# Altium schematic sheet 425AK01A_S10.SchDoc
size A3; DocumentNumber: 10; SheetNumber: 10; SheetTotal: 10; PageSetup: Record=PageOptions|CenterHorizontal=True|CenterVertical=True|PrintScale=1.01|XCorrection=1.00|YCorrection=1.00|PrintKind=1|BorderSize=5000000|LeftOffset=0|BottomOffset=0|Orientation=2|PaperLength=1000|PaperWidth=1000|Scale=100|PaperSource=15|PrintQuality=600|MediaType=1|DitherType=10|PaperKind=A3|PrintScaleMode=1; 00_Drawn: RJG; 00_Date: 8APR2022; 00_Checked: SR; 00_Approved: GN; 00_Line1: PSUs
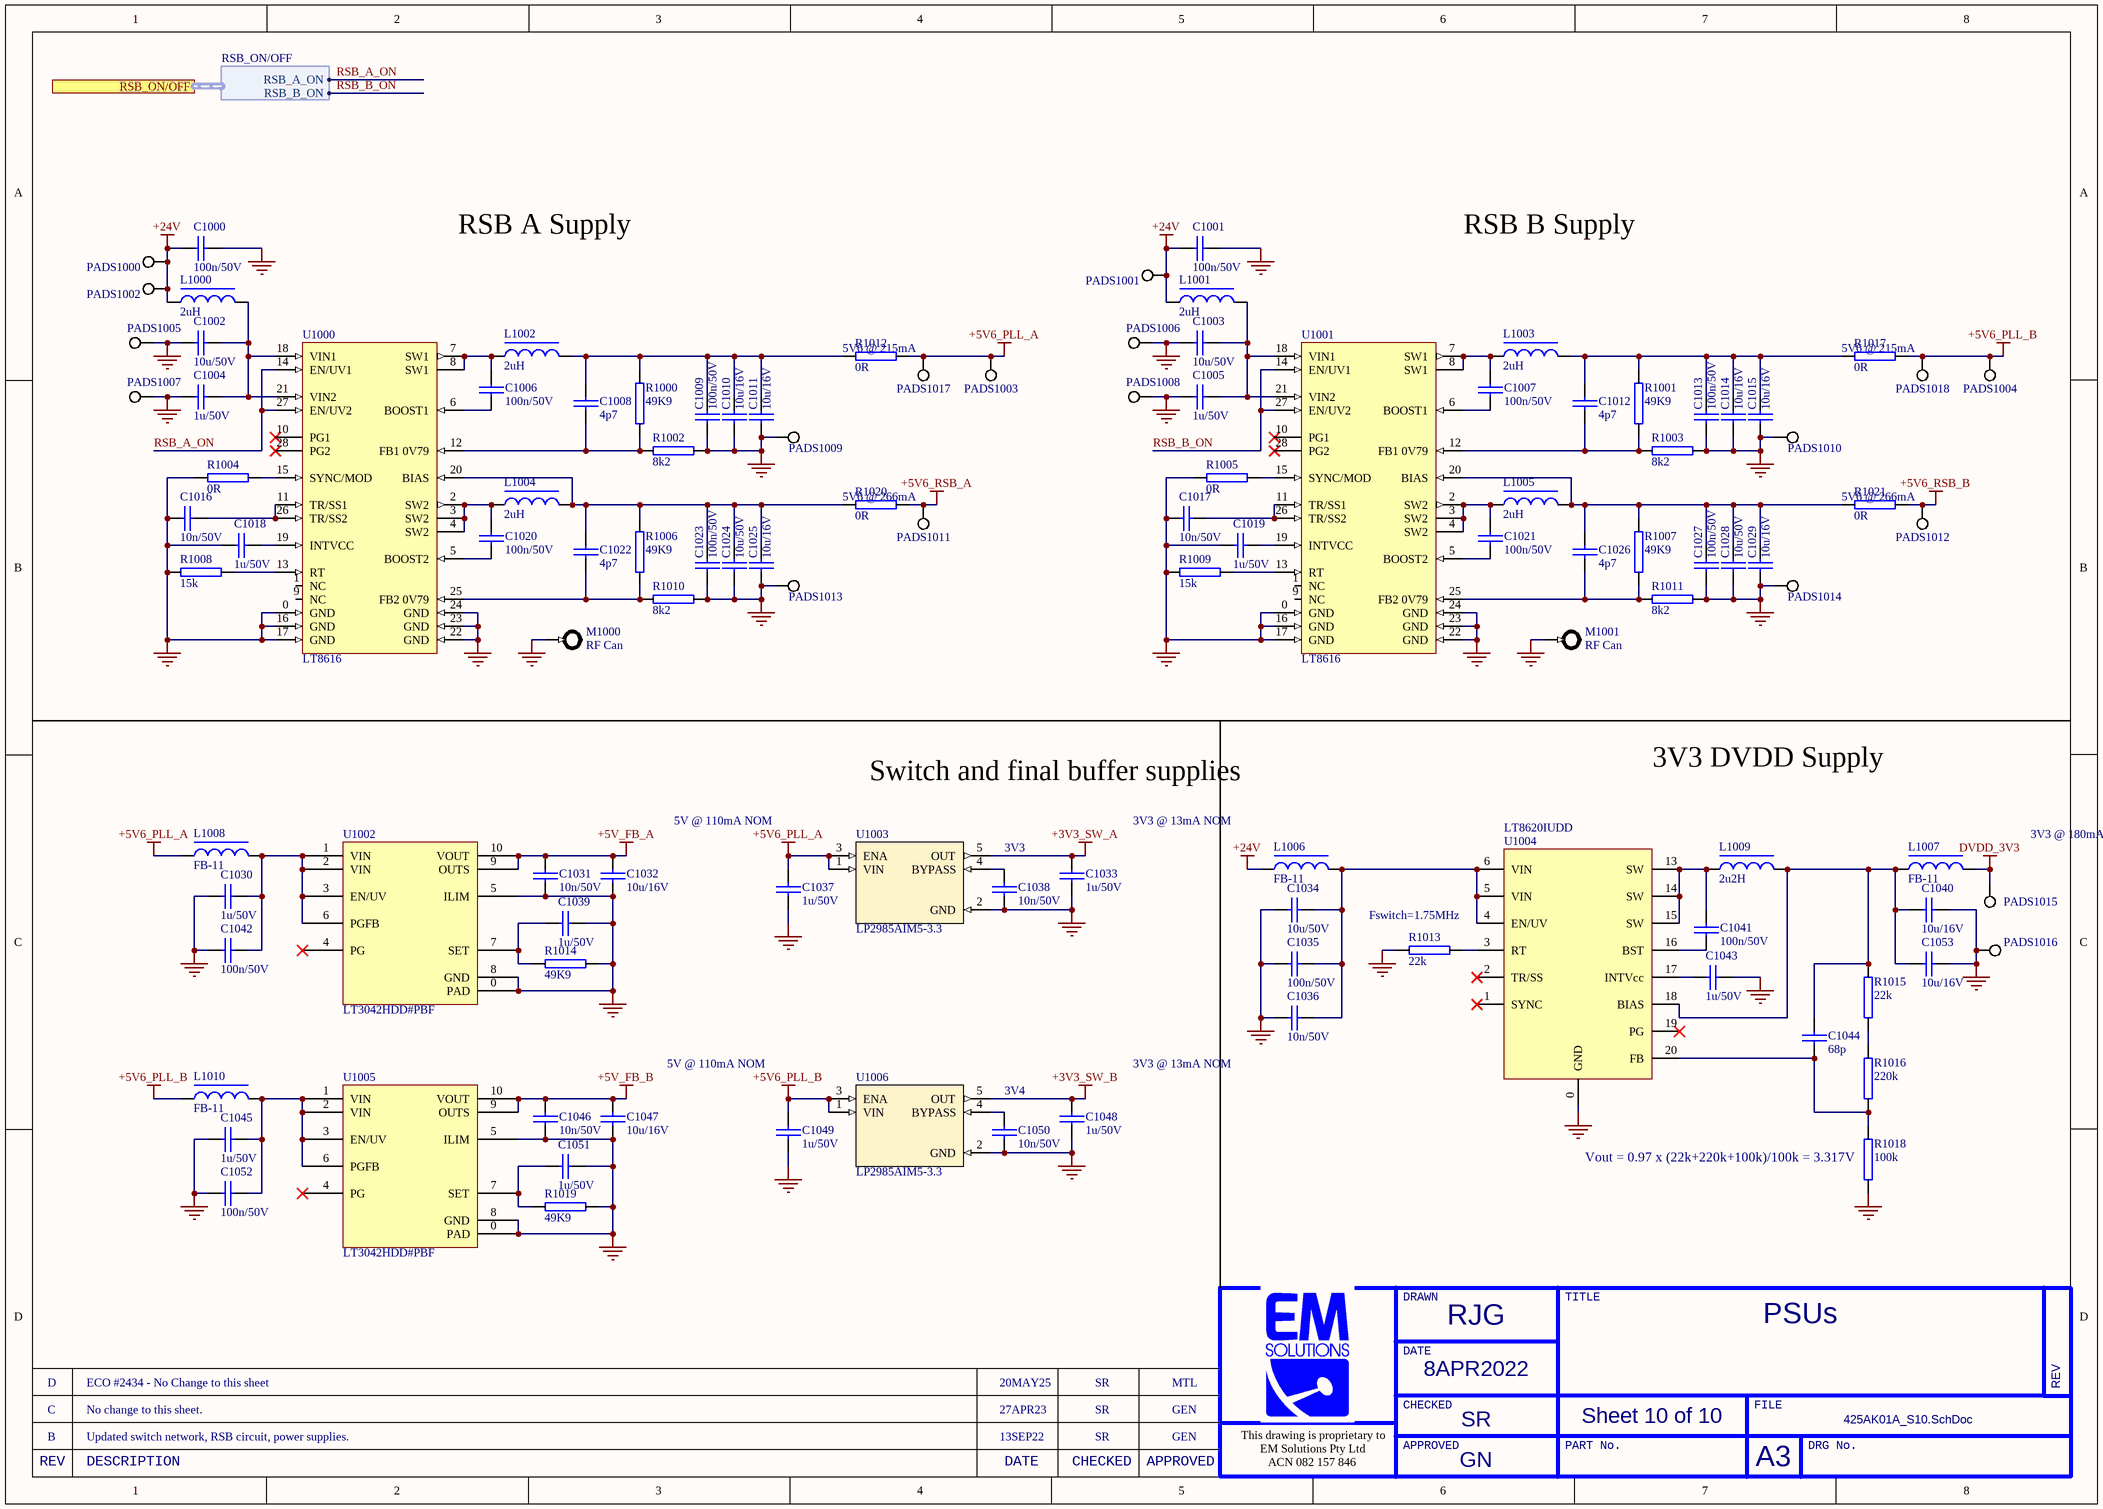
[diagram p0: 425AK01A_S10.SchDoc]

## Parts
C1000  100n/50V  [0402C]
C1001  100n/50V  [0402C]
C1002  10u/50V  [1206C]
C1003  10u/50V  [1206C]
C1004  1u/50V  [0603C]
C1005  1u/50V  [0603C]
C1006  100n/50V  [0402C]
C1007  100n/50V  [0402C]
C1008  4p7  [0402C]
C1009  100n/50V  [0402C]
C1010  10u/16V  [0805C]
C1011  10u/16V  [0805C]
C1012  4p7  [0402C]
C1013  100n/50V  [0402C]
C1014  10u/16V  [0805C]
C1015  10u/16V  [0805C]
C1016  10n/50V  [0402C]
C1017  10n/50V  [0402C]
C1018  1u/50V  [0603C]
C1019  1u/50V  [0603C]
C1020  100n/50V  [0402C]
C1021  100n/50V  [0402C]
C1022  4p7  [0402C]
C1023  100n/50V  [0402C]
C1024  10u/50V  [1206C]
C1025  10u/16V  [0805C]
C1026  4p7  [0402C]
C1027  100n/50V  [0402C]
C1028  10u/50V  [1206C]
C1029  10u/16V  [0805C]
C1030  1u/50V  [0603C]
C1031  10n/50V  [0402C]
C1032  10u/16V  [0805C]
C1033  1u/50V  [0603C]
C1034  10u/50V  [1206C]
C1035  100n/50V  [0402C]
C1036  10n/50V  [0402C]
C1037  1u/50V  [0603C]
C1038  10n/50V  [0402C]
C1039  1u/50V  [0603C]
C1040  10u/16V  [0805C]
C1041  100n/50V  [0402C]
C1042  100n/50V  [0402C]
C1043  1u/50V  [0603C]
C1044  68p  [0402C]
C1045  1u/50V  [0603C]
C1046  10n/50V  [0402C]
C1047  10u/16V  [0805C]
C1048  1u/50V  [0603C]
C1049  1u/50V  [0603C]
C1050  10n/50V  [0402C]
C1051  1u/50V  [0603C]
C1052  100n/50V  [0402C]
C1053  10u/16V  [0805C]
L1000  2uH  [XFL4030]
L1001  2uH  [XFL4030]
L1002  2uH  [XFL4030]
L1003  2uH  [XFL4030]
L1004  2uH  [XFL4030]
L1005  2uH  [XFL4030]
L1006  FB-11  [0402L]
L1007  FB-11  [0402L]
L1008  FB-11  [0402L]
L1009  2u2H  [0805L]
L1010  FB-11  [0402L]
M1000  RF Can  [Can_38x25.4x6mm]
M1001  RF Can  [Can_38x25.4x6mm]
PADS1000  Pads  [Pads-1x3-V3-0.3/0.6mm]  (value not drawn)  (net tie, no BOM)
PADS1001  Pads  [Pads-1x3-V3-0.3/0.6mm]  (value not drawn)  (net tie, no BOM)
PADS1002  Pads  [Pads-1x3-V3-0.3/0.6mm]  (value not drawn)  (net tie, no BOM)
PADS1003  Pads  [Pads-1x3-V3-0.3/0.6mm]  (value not drawn)  (net tie, no BOM)
PADS1004  Pads  [Pads-1x3-V3-0.3/0.6mm]  (value not drawn)  (net tie, no BOM)
PADS1005  Pads  [Pads-1x3-V3-0.3/0.6mm]  (value not drawn)  (net tie, no BOM)
PADS1006  Pads  [Pads-1x3-V3-0.3/0.6mm]  (value not drawn)  (net tie, no BOM)
PADS1007  Pads  [Pads-1x3-V3-0.3/0.6mm]  (value not drawn)  (net tie, no BOM)
PADS1008  Pads  [Pads-1x3-V3-0.3/0.6mm]  (value not drawn)  (net tie, no BOM)
PADS1009  Pads  [Pads-1x3-V3-0.3/0.6mm]  (value not drawn)  (net tie, no BOM)
PADS1010  Pads  [Pads-1x3-V3-0.3/0.6mm]  (value not drawn)  (net tie, no BOM)
PADS1011  Pads  [Pads-1x3-V3-0.3/0.6mm]  (value not drawn)  (net tie, no BOM)
PADS1012  Pads  [Pads-1x3-V3-0.3/0.6mm]  (value not drawn)  (net tie, no BOM)
PADS1013  Pads  [Pads-1x3-V3-0.3/0.6mm]  (value not drawn)  (net tie, no BOM)
PADS1014  Pads  [Pads-1x3-V3-0.3/0.6mm]  (value not drawn)  (net tie, no BOM)
PADS1015  Pads  [Pads-1x3-V3-0.3/0.6mm]  (value not drawn)  (net tie, no BOM)
PADS1016  Pads  [Pads-1x3-V3-0.3/0.6mm]  (value not drawn)  (net tie, no BOM)
PADS1017  Pads  [Pads-1x3-V3-0.3/0.6mm]  (value not drawn)  (net tie, no BOM)
PADS1018  Pads  [Pads-1x3-V3-0.3/0.6mm]  (value not drawn)  (net tie, no BOM)
R1000  49K9  [0402]
R1001  49K9  [0402]
R1002  8k2  [0402]
R1003  8k2  [0402]
R1004  0R  [0402]
R1005  0R  [0402]
R1006  49K9  [0402]
R1007  49K9  [0402]
R1008  15k  [0402]
R1009  15k  [0402]
R1010  8k2  [0402]
R1011  8k2  [0402]
R1012  0R  [0402]
R1013  22k  [0402]
R1014  49K9  [0402]
R1015  22k  [0402]
R1016  220k  [0402]
R1017  0R  [0402]
R1018  100k  [0402]
R1019  49K9  [0402]
R1020  0R  [0402]
R1021  0R  [0402]
U1000  LT8616  [QFN28-6x3mm]
U1001  LT8616  [QFN28-6x3mm]
U1002  LT3042HDD#PBF  [DFN50P300X300X80_HS-11N]
U1003  LP2985AIM5-3.3  [SOT-23/5]
U1004  LT8620IUDD  [QFN24-5x3mm]
U1005  LT3042HDD#PBF  [DFN50P300X300X80_HS-11N]
U1006  LP2985AIM5-3.3  [SOT-23/5]

## Ports
RSB_ON/OFF (harness RSB_ON/OFF)

## Harnesses
RSB_ON/OFF: RSB_A_ON, RSB_B_ON

## Nets
+3V3_SW_A: C1033.2 U1003.5(OUT)
+3V3_SW_B: C1048.2 U1006.5(OUT)
+5V6_PLL_A: C1037.2 L1008.2 PADS1003.1 PADS1017.1 R1012.1 U1003.1(VIN) U1003.3(ENA)
+5V6_PLL_B: C1049.2 L1010.2 PADS1004.1 PADS1018.1 R1017.1 U1006.1(VIN) U1006.3(ENA)
+5V6_RSB_A: PADS1011.1 R1020.1
+5V6_RSB_B: PADS1012.1 R1021.1
+5V_FB_A: C1031.2 C1032.1 U1002.9(OUTS) U1002.10(VOUT)
+5V_FB_B: C1046.2 C1047.1 U1005.9(OUTS) U1005.10(VOUT)
+24V: C1000.1 C1001.1 L1000.1 L1001.1 L1006.1 PADS1000.1 PADS1001.1 PADS1002.1
DVDD_3V3: L1007.2 PADS1015.1
GND: C1000.2 C1001.2 C1002.1 C1003.1 C1004.1 C1005.1 C1009.2 C1010.1 C1011.2 C1013.2 C1014.1 C1015.2 C1016.1 C1017.1 C1018.1 C1019.1 C1023.2 C1024.1 C1025.2 C1027.2 C1028.1 C1029.2 C1030.1 C1031.1 C1032.2 C1033.1 C1034.2 C1035.2 C1036.2 C1037.1 C1038.1 C1039.2 C1040.2 C1042.2 C1043.2 C1045.1 C1046.1 C1047.2 C1048.1 C1049.1 C1050.1 C1051.2 C1052.2 C1053.2 M1000.0 M1001.0 PADS1005.1 PADS1006.1 PADS1007.1 PADS1008.1 PADS1009.1 PADS1010.1 PADS1013.1 PADS1014.1 PADS1016.1 R1002.1 R1003.1 R1004.2 R1005.2 R1008.2 R1009.2 R1010.1 R1011.1 R1013.2 R1014.1 R1018.1 R1019.1 U1000.0(GND) U1000.16(GND) U1000.17(GND) U1000.22(GND) U1000.23(GND) U1000.24(GND) U1001.0(GND) U1001.16(GND) U1001.17(GND) U1001.22(GND) U1001.23(GND) U1001.24(GND) U1002.0(PAD) U1002.5(ILIM) U1002.8(GND) U1003.2(GND) U1004.0(GND) U1004.8(GND) U1004.9(GND) U1004.10(NC) U1004.11(NC) U1004.12(NC) U1004.21(NC) U1004.22(NC) U1004.23(NC) U1004.24(NC) U1005.0(PAD) U1005.5(ILIM) U1005.8(GND) U1006.2(GND)
RSB_A_ON: U1000.14(EN/UV1) U1000.27(EN/UV2) ; port RSB_ON/OFF.RSB_A_ON
RSB_B_ON: U1001.14(EN/UV1) U1001.27(EN/UV2) ; port RSB_ON/OFF.RSB_B_ON
NetC1002_2: C1002.2 C1004.2 L1000.2 U1000.18(VIN1) U1000.21(VIN2)
NetC1003_2: C1003.2 C1005.2 L1001.2 U1001.18(VIN1) U1001.21(VIN2)
NetC1006_1: C1006.1 L1002.1 U1000.7(SW1) U1000.8(SW1)
NetC1006_2: C1006.2 U1000.6(BOOST1)
NetC1007_1: C1007.1 L1003.1 U1001.7(SW1) U1001.8(SW1)
NetC1007_2: C1007.2 U1001.6(BOOST1)
NetC1008_1: C1008.1 C1009.1 C1010.2 C1011.1 L1002.2 R1000.2 R1012.2
NetC1008_2: C1008.2 R1000.1 R1002.2 U1000.12(FB1_0V79)
NetC1012_1: C1012.1 C1013.1 C1014.2 C1015.1 L1003.2 R1001.2 R1017.2
NetC1012_2: C1012.2 R1001.1 R1003.2 U1001.12(FB1_0V79)
NetC1016_2: C1016.2 U1000.11(TR/SS1) U1000.26(TR/SS2)
NetC1017_2: C1017.2 U1001.11(TR/SS1) U1001.26(TR/SS2)
NetC1018_2: C1018.2 U1000.19(INTVCC)
NetC1019_2: C1019.2 U1001.19(INTVCC)
NetC1020_1: C1020.1 L1004.1 U1000.2(SW2) U1000.3(SW2) U1000.4(SW2)
NetC1020_2: C1020.2 U1000.5(BOOST2)
NetC1021_1: C1021.1 L1005.1 U1001.2(SW2) U1001.3(SW2) U1001.4(SW2)
NetC1021_2: C1021.2 U1001.5(BOOST2)
NetC1022_1: C1022.1 C1023.1 C1024.2 C1025.1 L1004.2 R1006.2 R1020.2 U1000.20(BIAS)
NetC1022_2: C1022.2 R1006.1 R1010.2 U1000.25(FB2_0V79)
NetC1026_1: C1026.1 C1027.1 C1028.2 C1029.1 L1005.2 R1007.2 R1021.2 U1001.20(BIAS)
NetC1026_2: C1026.2 R1007.1 R1011.2 U1001.25(FB2_0V79)
NetC1030_2: C1030.2 C1042.1 L1008.1 U1002.1(VIN) U1002.2(VIN) U1002.3(EN/UV) U1002.6(PGFB)
NetC1034_1: C1034.1 C1035.1 C1036.1 L1006.2 U1004.4(EN/UV) U1004.5(VIN) U1004.6(VIN)
NetC1038_2: C1038.2 U1003.4(BYPASS)
NetC1039_1: C1039.1 R1014.2 U1002.7(SET)
NetC1040_1: C1040.1 C1044.2 C1053.1 L1007.1 L1009.2 R1015.2 U1004.18(BIAS)
NetC1041_1: C1041.1 U1004.16(BST)
NetC1041_2: C1041.2 L1009.1 U1004.13(SW) U1004.14(SW) U1004.15(SW)
NetC1043_1: C1043.1 U1004.17(INTVcc)
NetC1044_1: C1044.1 R1016.1 R1018.2 U1004.20(FB)
NetC1045_2: C1045.2 C1052.1 L1010.1 U1005.1(VIN) U1005.2(VIN) U1005.3(EN/UV) U1005.6(PGFB)
NetC1050_2: C1050.2 U1006.4(BYPASS)
NetC1051_1: C1051.1 R1019.2 U1005.7(SET)
NetR1004_1: R1004.1 U1000.15(SYNC/MOD)
NetR1005_1: R1005.1 U1001.15(SYNC/MOD)
NetR1008_1: R1008.1 U1000.13(RT)
NetR1009_1: R1009.1 U1001.13(RT)
NetR1013_1: R1013.1 U1004.3(RT)
NetR1015_1: R1015.1 R1016.2

Not connected (* = marked no-connect by the designer): U1000 1(NC) 9(NC) 10(PG1)* 28(PG2)*; U1001 1(NC) 9(NC) 10(PG1)* 28(PG2)*; U1002 4(PG)*; U1004 1(SYNC)* 2(TR/SS)* 7(NC) 19(PG)*; U1005 4(PG)*

## Notes on the sheet
- RSB A Supply
- RSB B Supply
- (near R1012) 5V6 @ 215mA
- (near R1017) 5V6 @ 215mA
- (near R1020) 5V6 @ 266mA
- (near R1021) 5V6 @ 266mA
- Switch and final buffer supplies
- 3V3 DVDD Supply
- 5V @ 110mA NOM
- 3V3
- (near C1033) 3V3 @ 13mA NOM
- (near L1007) 3V3 @ 180mA
- Fswitch=1.75MHz
- 3V4
- (near C1048) 3V3 @ 13mA NOM
- (near R1018) Vout = 0.97 x (22k+220k+100k)/100k = 3.317V
- D
- ECO #2434 - No Change to this sheet
- 20MAY25
- SR
- MTL
- B
- C
- Updated switch network, RSB circuit, power supplies.
- No change to this sheet.
- 13SEP22
- 27APR23
- GEN
- DRAWN
- TITLE
- DATE
- REV
- This drawing is proprietary to
- EM Solutions Pty Ltd
- APPROVED
- CHECKED
- PART No.
- FILE
- A3
- DRG No.
- DESCRIPTION
- ACN 082 157 846

## Library data of the parts
C1000 C1001 C1006 C1007 C1009 C1013 C1020 C1021 C1023 C1027 C1035 = 41-100N-13: Capacitor, 0402, 100n, X7R, 10% 50V, Ceramic; MANUFACTURER: MURATA; MODELNAME: GRM155R71H104KE14J; ID: 2441; Part Number: 41-100N-13; ItemID: 41-100N-13
C1002 C1003 C1024 C1028 = 41-010U-13: Capacitor, 1206, 10u X7R 10% 50V Ceramic, NiSn; MANUFACTURER: SAMSUNG; ID: 2237; MODELNAME: CL31B106KBHNNNE; Part Number: 41-010U-13; ItemID: 41-010U-13
C1004 C1005 C1018 C1019 = 41-01U0-06: Capacitor, 0603, 1u X7R 10% 50V Ceramic, NiSn; MANUFACTURER: TAIYOYUDEN; ID: 2287; MODELNAME: UMK107AB7105KA; Part Number: 41-01U0-06; ItemID: 41-01U0-06
C1008 C1012 C1022 C1026 = 41-04P7-05: Capacitor, 0402, 4p7 NPO +/-0.1p 50V Ceramic, NiSn, Low ESR; MANUFACTURER: AVX; ID: 2381; MODELNAME: 04025U4R7BAT2A; Part Number: 41-04P7-05; ItemID: 41-04P7-05
C1010 C1011 C1014 C1015 C1025 C1029 C1032 C1040 C1047 C1053 = 41-010U-08: Capacitor, 0805, 10u X7R 10% 16V Ceramic, NiSn; MANUFACTURER: SAMSUNG; ID: 2232; MODELNAME: CL21B106KOQNNNE; Part Number: 41-010U-08; ItemID: 41-010U-08
C1016 C1017 C1031 C1038 C1046 C1050 = 41-010N-12: Capacitor, 0402, 10n X7R 10% 50V Ceramic, NiSn; MANUFACTURER: MURATA; ID: 2217; MODELNAME: GCM155R71H103KA55D; Part Number: 41-010N-12; ItemID: 41-010N-12
C1030 C1033 C1037 C1039 C1043 C1045 C1048 C1049 C1051 = 41-01U0-06: Capacitor, 0603, 1u X7R 10% 50V Ceramic, NiSn; MANUFACTURER: TAIYOYUDEN; MODELNAME: UMK107AB7105KA; ID: 2287; Part Number: 41-01U0-06; ItemID: 41-01U0-06
C1034 = 41-010U-13: Capacitor, 1206, 10u X7R 10% 50V Ceramic, NiSn; MANUFACTURER: SAMSUNG; MODELNAME: CL31B106KBHNNNE; ID: 2237; Part Number: 41-010U-13; ItemID: 41-010U-13
C1036 = 41-010N-12: Capacitor, 0402, 10n X7R 10% 50V Ceramic, NiSn; MANUFACTURER: MURATA; MODELNAME: GCM155R71H103KA55D; ID: 2217; Part Number: 41-010N-12; ItemID: 41-010N-12
C1041 C1042 C1052 = 41-100N-13: Capacitor, 0402, 100n, X7R, 10% 50V, Ceramic; MANUFACTURER: MURATA; ID: 2441; MODELNAME: GRM155R71H104KE14J; Part Number: 41-100N-13; ItemID: 41-100N-13
C1044 = 41-068P-08: Capacitor, 0402, 68p NPO 2% 50V Ceramic, NiSn; MANUFACTURER: MURATA; ID: 4027; MODELNAME: GRM1555C1H680GA01D; Part Number: 41-068P-08; ItemID: 41-068P-08
L1000-L1005 = Inductor 2uH 46-02U0-01: Inductor, 2uH 20% 0.011R 2.5A, 4x4mm Shield, XFL4030 Ser; MANUFACTURER: COILCRAFT; ID: 3146; MODELNAME: XFL4030-202MEC; Part Number: 46-02U0-01; ItemID: 46-02U0-01
L1006-L1008 L1010 = 46-B-11: Solid Inductor, 600ohm@100MHz, DCR=0.52, 0.3A, 0402 size; MANUFACTURER: TDK; MODELNAME: MMZ1005S601C; ID: 3256; Part Number: 46-B-11; ItemID: 46-B-11
L1009 = 46-02U2-01: Inductor, Chip, 2u2H 10%, 0805, SIMID08B Series; MANUFACTURER: EPCOS; MODELNAME: B82498F1222J000; ID: 3171; Part Number: 46-02U2-01; ItemID: 46-02U2-01
M1000 M1001 = Can-RF: Part Number: 11-0256
PADS1000-PADS1018 = Pads: Cluster of pads
R1000 R1001 R1006 R1007 = 44-49K9-01: Resistor, 0402, 49.9K, 1%, 0.1W, ThickFilm, AEC-Q200; MANUFACTURER: PANASONIC; ID: 3061; MODELNAME: ERJ-2RKF4992X; Part Number: 44-49K9-01; ItemID: 44-49K9-01
R1002 R1003 R1010 R1011 = 44-08K2-10: Resistor, 0402, 8k2 1% 0.063W; MANUFACTURER: GENERIC; ID: 2891; Part Number: 44-08K2-10; ItemID: 44-08K2-10; MODELNAME: GENERIC
R1004 R1005 R1012 R1017 R1020 R1021 = 44-000R-10: Resistor, 0402, 0R 1% 0.063W; MANUFACTURER: PHILIPS; ID: 2538; MODELNAME: CRG0402ZR; Part Number: 44-000R-10; ItemID: 44-000R-10
R1008 R1009 = 44-015K-10: Resistor, 0402, 15k 1% 0.063W; MANUFACTURER: GENERIC; ID: 2575; Part Number: 44-015K-10; ItemID: 44-015K-10; MODELNAME: GENERIC
R1013 = 44-022K-10: Resistor, 0402, 22k 1% 0.063W; MANUFACTURER: PHILIPS; MODELNAME: RC32H; ID: 2661; Part Number: 44-022K-10; ItemID: 44-022K-10
R1014 R1019 = 44-49K9-01: Resistor, 0402, 49.9K, 1%, 0.1W, ThickFilm, AEC-Q200; MANUFACTURER: PANASONIC; MODELNAME: ERJ-2RKF4992X; ID: 3061; Part Number: 44-49K9-01; ItemID: 44-49K9-01
R1015 = 44-022K-10: Resistor, 0402, 22k 1% 0.063W; MANUFACTURER: GENERIC; ID: 2661; Part Number: 44-022K-10; ItemID: 44-022K-10; MODELNAME: GENERIC
R1016 = 44-220K-10: Resistor, 0402, 220k 1% 0.063W; MANUFACTURER: PHILIPS; MODELNAME: RC32H; ID: 2994; Part Number: 44-220K-10; ItemID: 44-220K-10
R1018 = 44-100K-10: Resistor, 0402, 100k 1% 0.063W; MANUFACTURER: GENERIC; ID: 2931; Part Number: 44-100K-10; MODELNAME: GENERIC; ItemID: 44-100K-10
U1000 U1001 = LT8616EUDE: Dual SMPS, 3.4-42V, QFN28, high efficiency, 1.5A/2.5A output; Part Number: 54-8616-02
U1002 U1005 = 52-3042-01: Volt Regulator, Vin=1.8-20V, Vin=0-15V, 200mA, Low Noise, -40to+125C; MANUFACTURER: ANLG DEV; MODELNAME: LT3042IDD#PBF; ID: 3361; Part Number: 52-3042-01; ItemID: 52-3042-01
U1003 U1006 = Regulator-Linear-3V3-LP2985: Volt Regulator, 3.3V, 150mA, LoNoise, LDO, SOT-23/5; Part Number: 52-2985-06; MPN: LP2985AIM5-3.3/NOPB; Manufacturer: Texas Instruments
U1004 = 54-8620-01: *Switching Reg, Dual, 3.4V-65Vin, -40/125C, QFN24 3x5mm; MANUFACTURER: LIN TECH; MODELNAME: LT8620IUDD#PBF; ID: 3510; Part Number: 54-8620-01; ItemID: 54-8620-01